# Altium schematic sheet Hammerhead - Power R1.1.SchDoc
size A; SheetNumber: 7
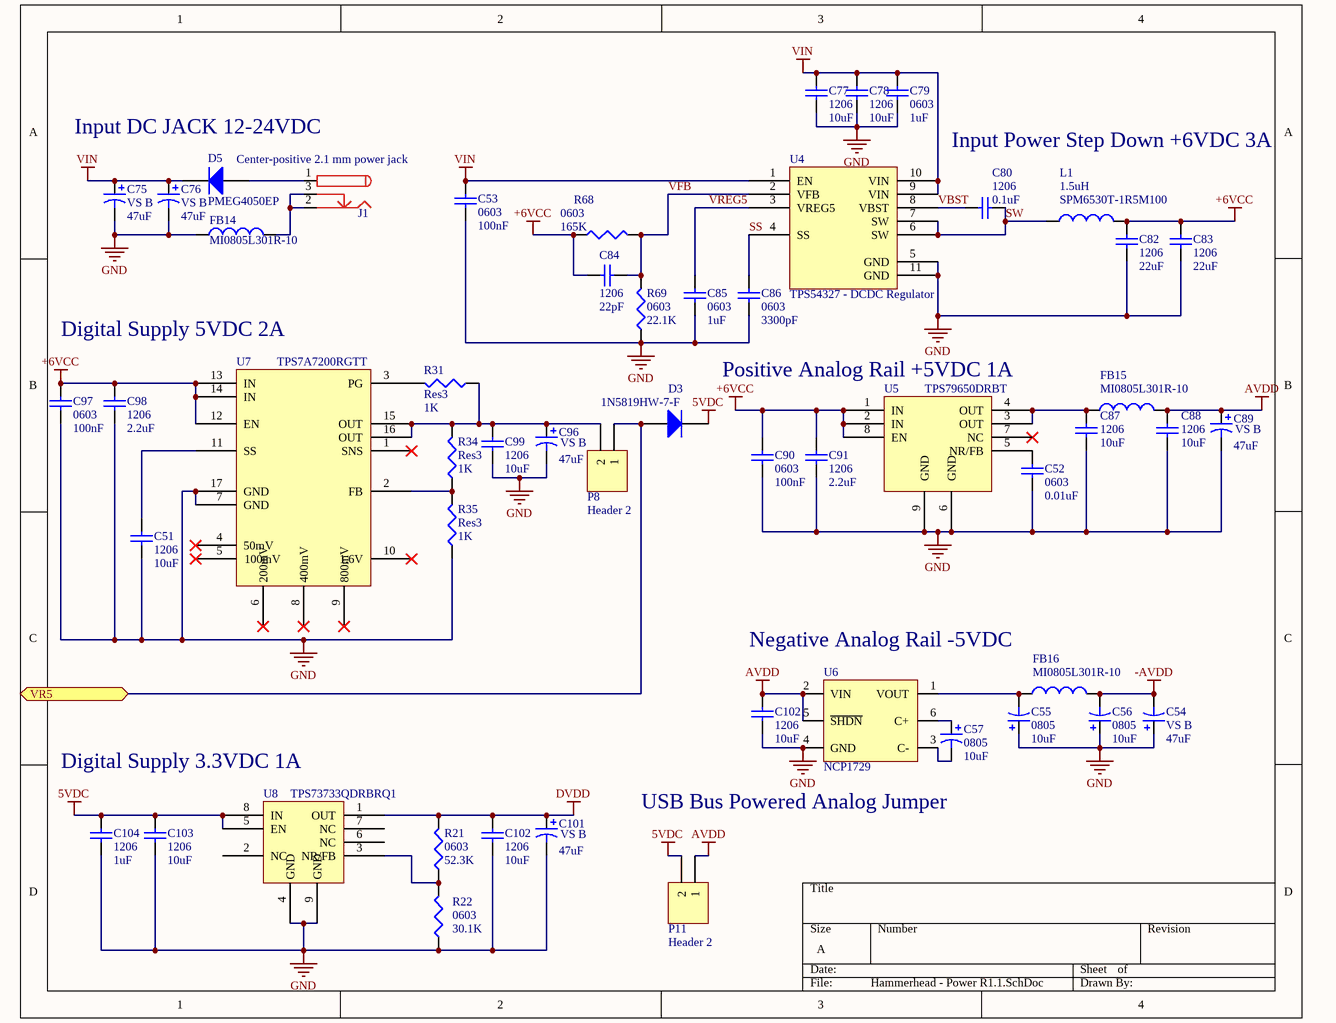
[diagram p0: Hammerhead - Power R1.1.SchDoc]

## Parts
(Parts that share a designator on the sheet are numbered #1, #2 ... from top to bottom, then left to right.)
C51  1206  value 10uF  [C1206]
C52  0603  value 0.01uF  [1608[0603]]
C53  0603  value 100nF  [1608[0603]]
C54  VS B  value 47uF  [Panasonic VS B]
C55  0805  value 10uF  [C0805]
C56  0805  value 10uF  [C0805]
C57  0805  value 10uF  [C0805]
C75  VS B  value 47uF  [Panasonic VS B]
C76  VS B  value 47uF  [Panasonic VS B]
C77  1206  value 10uF  [C1206]
C78  1206  value 10uF  [C1206]
C79  0603  value 1uF  [1608[0603]]
C80  1206  value 0.1uF  [C1206]
C82  1206  value 22uF  [C1206]
C83  1206  value 22uF  [C1206]
C84  1206  value 22pF  [C1206]
C85  0603  value 1uF  [1608[0603]]
C86  0603  value 3300pF  [1608[0603]]
C87  1206  value 10uF  [C1206]
C88  1206  value 10uF  [C1206]
C89  VS B  value 47uF  [Panasonic VS B]
C90  0603  value 100nF  [1608[0603]]
C91  1206  value 2.2uF  [C1206]
C96  VS B  value 47uF  [Panasonic VS B]
C97  0603  value 100nF  [1608[0603]]
C98  1206  value 2.2uF  [C1206]
C99  1206  value 10uF  [C1206]
C101  VS B  value 47uF  [Panasonic VS B]
C102#1  1206  value 10uF  [C1206]
C102#2  1206  value 10uF  [C1206]
C103  1206  value 10uF  [C1206]
C104  1206  value 1uF  [C1206]
D3  1N5819HW-7-F  [DIOM2715X14N]
D5  PMEG4050EP  [PMEG4050EP]
FB14  MI0805L301R-10  [SM 0805 - gap trimmed]
FB15  MI0805L301R-10  [SM 0805 - gap trimmed]
FB16  MI0805L301R-10  [SM 0805 - gap trimmed]
J1  Center-positive 2.1 mm power jack  [PJ-102AH]
L1  SPM6530T-1R5M100  value 1.5uH  [SPM6530T]
P8  Header 2  [HDR1X2]
P11  Header 2  [HDR1X2]
R21  0603  value 52.3K  [J1-0603]
R22  0603  value 30.1K  [J1-0603]
R31  Res3  value 1K  [J1-0603]
R34  Res3  value 1K  [J1-0603]
R35  Res3  value 1K  [J1-0603]
R68  0603  value 165K  [J1-0603]
R69  0603  value 22.1K  [J1-0603]
U4  TPS54327 - DCDC Regulator  [TPS54327]
U5  TPS79650DRBT  [QFN65P300X300X100_HS-17N]
U6  NCP1729  [SOT6]
U7  TPS7A7200RGTT  [QFN50P300X300X100_HS-17N]
U8  TPS73733QDRBRQ1  [QFN65P300X300X100_HS-17N - smaller pad]

## Ports
VR5

## Nets
5VDC: C103.2 C104.2 D3.2(K) P11.2 U8.5(EN) U8.8(IN)
+6VCC: C82.2 C83.2 C84.1 C90.2 C91.2 C97.2 C98.2 L1.2 R68.1 U5.1(IN) U5.2(IN) U5.8(EN) U7.12(EN) U7.13(IN) U7.14(IN)
-AVDD: C54.2 C56.2 FB16.2
AVDD: C88.2 C89.1 C102#1.2 FB15.2 P11.1 U6.2(VIN) U6.5(~{SHDN})
DVDD: C101.1 C102#2.2 R21.2 U8.1(OUT)
GND: C51.1 C52.1 C53.1 C54.1 C55.1 C56.1 C75.2 C76.2 C77.1 C78.1 C79.1 C82.1 C83.1 C85.1 C86.1 C87.1 C88.1 C89.2 C90.1 C91.1 C96.2 C97.1 C98.1 C99.1 C101.2 C102#1.1 C102#2.1 C103.1 C104.1 FB14.1 R22.1 R35.1 R69.1 U4.5(GND) U4.11(GND) U5.6(GND) U5.9(GND) U6.4(GND) U7.7(GND) U7.17(GND) U8.4(GND) U8.9(GND)
VIN: C53.2 C75.1 C76.1 C77.2 C78.2 C79.2 D5.1(A) U4.1(EN) U4.9(VIN) U4.10(VIN)
SS: C86.2 U4.4(SS)
SW: C80.2 L1.1 U4.6(SW) U4.7(SW)
VBST: C80.1 U4.8(VBST)
VFB: C84.2 R68.2 R69.2 U4.2(VFB)
VR5: D3.1(A) P8.1 ; port VR5
VREG5: C85.2 U4.3(VREG5)
NetC51_2: C51.2 U7.11(SS)
NetC52_2: C52.2 U5.5(NR/FB)
NetC55_2: C55.2 FB16.1 U6.1(VOUT)
NetC57_1: C57.1 U6.6(C+)
NetC57_2: C57.2 U6.3(C-)
NetC87_2: C87.2 FB15.1 U5.3(OUT) U5.4(OUT)
NetC96_1: C96.1 C99.2 P8.2 R31.1 R34.2 U7.15(OUT) U7.16(OUT)
NetD5_2: D5.2(K) J1.1
NetFB14_2: FB14.2 J1.2 J1.3
NetR21_1: R21.1 R22.2 U8.3(NR/FB)
NetR31_2: R31.2 U7.3(PG)
NetR34_1: R34.1 R35.2 U7.2(FB)

Not connected (* = marked no-connect by the designer): U5 7(NC)*; U7 1(SNS)* 4(50mV)* 5(100mV)* 6(200mV)* 8(400mV)* 9(800mV)* 10(1.6V)*; U8 2(NC) 6(NC) 7(NC)

## Notes on the sheet
- Input DC JACK 12-24VDC
- Input Power Step Down +6VDC 3A
- Digital Supply 5VDC 2A
- (near U5) Positive Analog Rail +5VDC 1A
- Negative Analog Rail -5VDC
- Digital Supply 3.3VDC 1A
- USB Bus Powered Analog Jumper

## Library data of the parts
C51-C53 C77-C80 C82-C88 C90 C91 C97-C99 C102#1 C102#2 C103 C104 = Cap Semi: Capacitor (Semiconductor SIM Model); Published: 8-Jun-2000; LatestRevisionDate: 29-May-2009; LatestRevisionNote: IPC-7351 Footprint Added.; PackageReference: C1206; Publisher: Altium Limited; PackageDescription: Chip Capacitor
C54-C57 C75 C76 C89 C96 C101 = Cap Pol3: Polarized Capacitor (Surface Mount); Published: 8-Jun-2000; LatestRevisionDate: 29-May-2009; LatestRevisionNote: IPC-7351 Footprint Added.; PackageReference: C0805; Publisher: Altium Limited; PackageDescription: Chip Capacitor
D5 = Diode: Default Diode; Published: 8-Jun-2000; LatestRevisionDate: 17-Jul-2002; LatestRevisionNote: Re-released for DXP Platform.; PackageVersion: Sep-1996; PackageReference: SMC; Publisher: Altium Limited; PackageDescription: DO-214-AB/SMC; 2 C-Bend Leads; Body 7.9 x 5.9 mm, inc. leads (LxW); Code_JEDEC: DO-214-AB
FB14-FB16 L1 = Inductor: Code_IEC: 1005; Published: 8-Jun-2000; PackageReference: 0402-A; Publisher: Altium Limited; Code_JEITA: 0402
  FB14-FB16: LatestRevisionDate: 17-Jul-2002; LatestRevisionNote: Re-released for DXP Platform.
  L1: LatestRevisionDate: 29-May-2009; LatestRevisionNote: IPC-7351 Footprint Added.; PackageDescription: Chip Inductor
J1 = PWR2.5: Power jack; Published: 17-Dec-2003; DatasheetDocument: 09-May-2002; Publisher: Altium Limited; ComponentLink1Description: Manufacturer Link; ComponentLink1URL: http://domino.kycon.com/internet/Products.html
P8 P11 = Header 2: Header, 2-Pin; LatestRevisionDate: 17-Jul-2002; LatestRevisionNote: Re-released for DXP Platform.; Publisher: Altium Limited
R21 R22 R31 R34 R35 R68 R69 = Res3: Resistor; Published: 8-Jun-2000; LatestRevisionDate: 29-May-2009; LatestRevisionNote: IPC-7351 Footprint Added.; PackageReference: J1-0603; Publisher: Altium Limited; PackageDescription: Chip Resistor
U5 = TPS796
U8 = TPS73733-Q1
D3 = 1N5819HW-7-F: Published: 8-Jun-2000; LatestRevisionDate: 17-Jul-2002; LatestRevisionNote: Re-released for DXP Platform.; PackageVersion: Sep-1996; PackageReference: SMC; Publisher: Altium Limited; PackageDescription: DO-214-AB/SMC; 2 C-Bend Leads; Body 7.9 x 5.9 mm, inc. leads (LxW); Code_JEDEC: DO-214-AB